# Altium project USB_BreakOut.PrjPcb
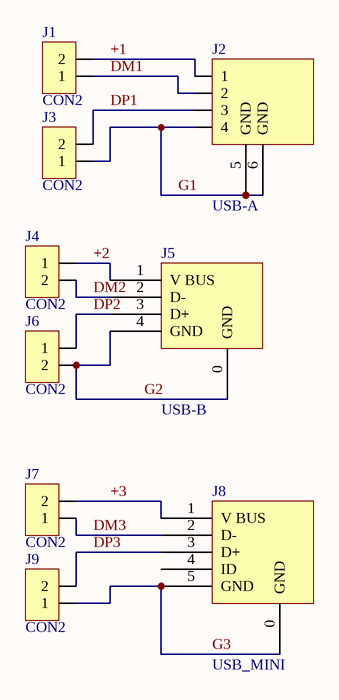
[diagram p0: USBA_Term.SchDoc]
1 sheet, 9 parts. Net scope: global (net labels, ports and power ports of the same name join across sheets).
Board file: USB_Term.PcbDoc

## Sheet USBA_Term.SchDoc
size A4

### Parts
J1  CON2  [TERMS5mm2]
J2  USB-A  [USB_A]
J3  CON2  [TERMS5mm2]
J4  CON2  [TERMS5mm2]
J5  USB-B  [USB_B]
J6  CON2  [TERMS5mm2]
J7  CON2  [TERMS5mm2]
J8  USB_MINI  [USB_MINI_B]
J9  CON2  [TERMS5mm2]

### Nets
+1: J1.2 J2.1
+2: J4.1 J5.1(V_BUS)
+3: J7.2 J8.1(V_BUS)
DM1: J1.1 J2.2
DM2: J4.2 J5.2(D-)
DM3: J7.1 J8.2(D-)
DP1: J2.3 J3.2
DP2: J5.3(D+) J6.1
DP3: J8.3(D+) J9.2
G1: J2.4 J2.5(GND) J2.6(GND) J3.1
G2: J5.0(GND) J5.4(GND) J6.2
G3: J8.0(GND) J8.5(GND) J9.1

Not connected (* = marked no-connect by the designer): J8 4(ID)